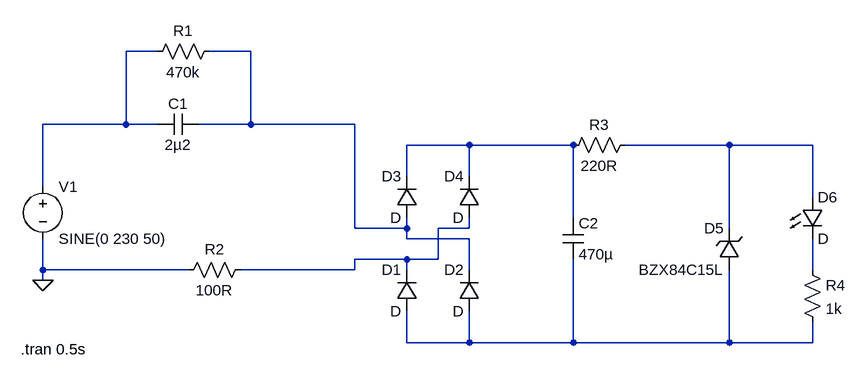
[diagram p0: schematic Draft1.asc]
Draft1.asc, the LTspice schematic file:
Version 4
SHEET 1 1180 680
WIRE 112 -80 64 -80
WIRE 256 -80 192 -80
WIRE 64 32 64 -80
WIRE 64 32 -64 32
WIRE 112 32 64 32
WIRE 256 32 256 -80
WIRE 256 32 176 32
WIRE 416 32 256 32
WIRE 592 64 496 64
WIRE 752 64 592 64
WIRE 992 64 832 64
WIRE 1120 64 992 64
WIRE 496 112 496 64
WIRE 592 112 592 64
WIRE -64 128 -64 32
WIRE 1120 144 1120 64
WIRE 752 176 752 64
WIRE 416 192 416 32
WIRE 496 192 496 176
WIRE 496 192 416 192
WIRE 592 192 592 176
WIRE 592 192 544 192
WIRE 992 192 992 64
WIRE 496 208 496 192
WIRE 592 208 496 208
WIRE 496 240 416 240
WIRE 544 240 544 192
WIRE 544 240 496 240
WIRE -64 256 -64 208
WIRE 160 256 -64 256
WIRE 416 256 416 240
WIRE 416 256 240 256
WIRE 496 256 496 240
WIRE 592 256 592 208
WIRE 1120 256 1120 208
WIRE -64 272 -64 256
WIRE 496 368 496 320
WIRE 592 368 592 320
WIRE 592 368 496 368
WIRE 752 368 752 240
WIRE 752 368 592 368
WIRE 992 368 992 256
WIRE 992 368 752 368
WIRE 1120 368 1120 336
WIRE 1120 368 992 368
FLAG -64 272 0
SYMBOL voltage -64 112 R0
WINDOW 123 0 0 Left 2
WINDOW 39 0 0 Left 2
SYMATTR InstName V1
SYMATTR Value SINE(0 230 50)
SYMBOL cap 176 16 R90
WINDOW 0 0 32 VBottom 2
WINDOW 3 32 32 VTop 2
SYMATTR InstName C1
SYMATTR Value 2µ2
SYMATTR SpiceLine V=400
SYMBOL res 208 -96 R90
WINDOW 0 0 56 VBottom 2
WINDOW 3 32 56 VTop 2
SYMATTR InstName R1
SYMATTR Value 470k
SYMATTR SpiceLine pwr=1
SYMBOL diode 512 320 R180
WINDOW 0 24 64 Left 2
WINDOW 3 24 0 Left 2
SYMATTR InstName D1
SYMBOL diode 608 320 R180
WINDOW 0 24 64 Left 2
WINDOW 3 24 0 Left 2
SYMATTR InstName D2
SYMBOL diode 512 176 R180
WINDOW 0 24 64 Left 2
WINDOW 3 24 0 Left 2
SYMATTR InstName D3
SYMBOL diode 608 176 R180
WINDOW 0 24 64 Left 2
WINDOW 3 24 0 Left 2
SYMATTR InstName D4
SYMBOL res 256 240 R90
WINDOW 0 0 56 VBottom 2
WINDOW 3 32 56 VTop 2
SYMATTR InstName R2
SYMATTR Value 100R
SYMATTR SpiceLine pwr=1
SYMBOL cap 736 176 R0
SYMATTR InstName C2
SYMATTR Value 470µ
SYMATTR SpiceLine V=16
SYMBOL res 848 48 R90
WINDOW 0 0 56 VBottom 2
WINDOW 3 32 56 VTop 2
SYMATTR InstName R3
SYMATTR Value 220R
SYMATTR SpiceLine pwr=1
SYMBOL zener 1008 256 R180
WINDOW 0 24 64 Left 2
WINDOW 3 24 0 Left 2
SYMATTR InstName D5
SYMATTR Value BZX84C15L
SYMBOL LED 1104 144 R0
SYMATTR InstName D6
SYMBOL res 1104 240 R0
SYMATTR InstName R4
SYMATTR Value 1k
TEXT -98 378 Left 2 !.tran 0.5s

The netlist it stands for:
* Draft1.asc
V1 N001 0 SINE(0 230 50)
C1 N002 N001 2µ2 V=400
R1 N002 N001 470k pwr=1
D1 N007 N005 D
D2 N007 N002 D
D3 N002 N003 D
D4 N005 N003 D
R2 N005 0 100R pwr=1
C2 N003 N007 470µ V=16
R3 N004 N003 220R pwr=1
D5 N007 N004 BZX84C15L
D6 N004 N006 D
R4 N006 N007 1k
.model D D
.lib standard.dio
.tran 0.5s
.backanno
.end